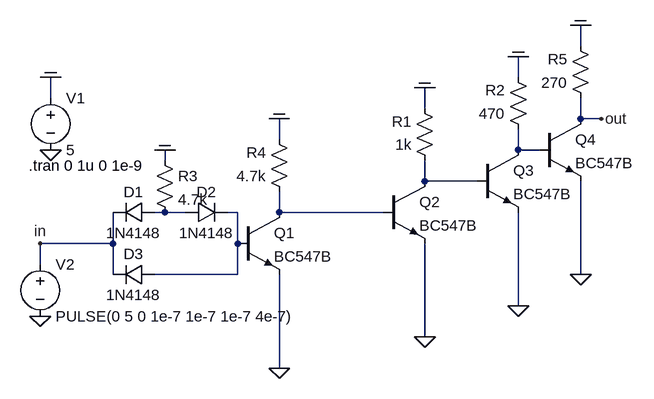
[diagram p0: schematic clock_inv.asc]
clock_inv.asc, the LTspice schematic file:
Version 4
SHEET 1 952 680
WIRE 864 144 864 112
WIRE 768 192 768 160
WIRE 48 224 48 192
WIRE 624 240 624 208
WIRE 864 256 864 224
WIRE 896 256 864 256
WIRE 400 288 400 256
WIRE 768 304 768 272
WIRE 800 304 768 304
WIRE 224 320 224 304
WIRE 624 352 624 320
WIRE 704 352 624 352
WIRE 224 400 208 400
WIRE 256 400 224 400
WIRE 336 400 320 400
WIRE 400 400 400 368
WIRE 560 400 400 400
WIRE 144 448 144 400
WIRE 144 448 32 448
WIRE 336 448 336 400
WIRE 32 480 32 448
WIRE 144 496 144 448
WIRE 336 496 336 448
WIRE 336 496 208 496
WIRE 864 496 864 352
WIRE 768 544 768 400
WIRE 624 592 624 448
WIRE 400 640 400 496
FLAG 48 304 0
FLAG 48 192 COM
FLAG 32 560 0
FLAG 32 448 in
FLAG 400 640 0
FLAG 400 256 COM
FLAG 624 592 0
FLAG 624 208 COM
FLAG 768 544 0
FLAG 768 160 COM
FLAG 224 304 COM
FLAG 864 496 0
FLAG 864 112 COM
FLAG 896 256 out
SYMBOL voltage 48 208 R0
WINDOW 123 0 0 Left 2
WINDOW 39 0 0 Left 2
SYMATTR InstName V1
SYMATTR Value 5
SYMBOL voltage 32 464 R0
WINDOW 123 0 0 Left 2
WINDOW 39 0 0 Left 2
SYMATTR InstName V2
SYMATTR Value PULSE(0 5 0 1e-7 1e-7 1e-7 4e-7)
SYMBOL npn 336 400 R0
SYMATTR InstName Q1
SYMATTR Value BC547B
SYMBOL res 416 384 R180
WINDOW 0 36 76 Left 2
WINDOW 3 36 40 Left 2
SYMATTR InstName R4
SYMATTR Value 4.7k
SYMBOL npn 560 352 R0
SYMATTR InstName Q2
SYMATTR Value BC547B
SYMBOL res 640 336 R180
WINDOW 0 36 76 Left 2
WINDOW 3 36 40 Left 2
SYMATTR InstName R1
SYMATTR Value 1k
SYMBOL npn 704 304 R0
SYMATTR InstName Q3
SYMATTR Value BC547B
SYMBOL res 784 288 R180
WINDOW 0 36 76 Left 2
WINDOW 3 36 40 Left 2
SYMATTR InstName R2
SYMATTR Value 470
SYMBOL diode 208 384 R90
WINDOW 0 0 32 VBottom 2
WINDOW 3 32 32 VTop 2
SYMATTR InstName D1
SYMATTR Value 1N4148
SYMBOL diode 256 416 R270
WINDOW 0 32 32 VTop 2
WINDOW 3 0 32 VBottom 2
SYMATTR InstName D2
SYMATTR Value 1N4148
SYMBOL diode 208 480 R90
WINDOW 0 0 32 VBottom 2
WINDOW 3 32 32 VTop 2
SYMATTR InstName D3
SYMATTR Value 1N4148
SYMBOL res 208 304 R0
SYMATTR InstName R3
SYMATTR Value 4.7k
SYMBOL npn 800 256 R0
SYMATTR InstName Q4
SYMATTR Value BC547B
SYMBOL res 880 240 R180
WINDOW 0 36 76 Left 2
WINDOW 3 36 40 Left 2
SYMATTR InstName R5
SYMATTR Value 270
TEXT 14 328 Left 2 !.tran 0 1u 0 1e-9

The netlist it stands for:
* clock_inv.asc
V1 COM 0 5
V2 in 0 PULSE(0 5 0 1e-7 1e-7 1e-7 4e-7)
Q1 N005 N004 0 0 BC547B
R4 N005 COM 4.7k
Q2 N002 N005 0 0 BC547B
R1 N002 COM 1k
Q3 N001 N002 0 0 BC547B
R2 N001 COM 470
D1 N003 in 1N4148
D2 N003 N004 1N4148
D3 N004 in 1N4148
R3 COM N003 4.7k
Q4 out N001 0 0 BC547B
R5 out COM 270
.model D D
.lib standard.dio
.model NPN NPN
.model PNP PNP
.lib standard.bjt
.tran 0 1u 0 1e-9
.backanno
.end